# EasyEDA schematic SCH_Visualizer_2026-05-25.json
TITLE: Visualizer; REV: 1.0; Date: 2026-05-23; Sheet: 1/1; Drawn By: jshimamoto; Company: Your Company
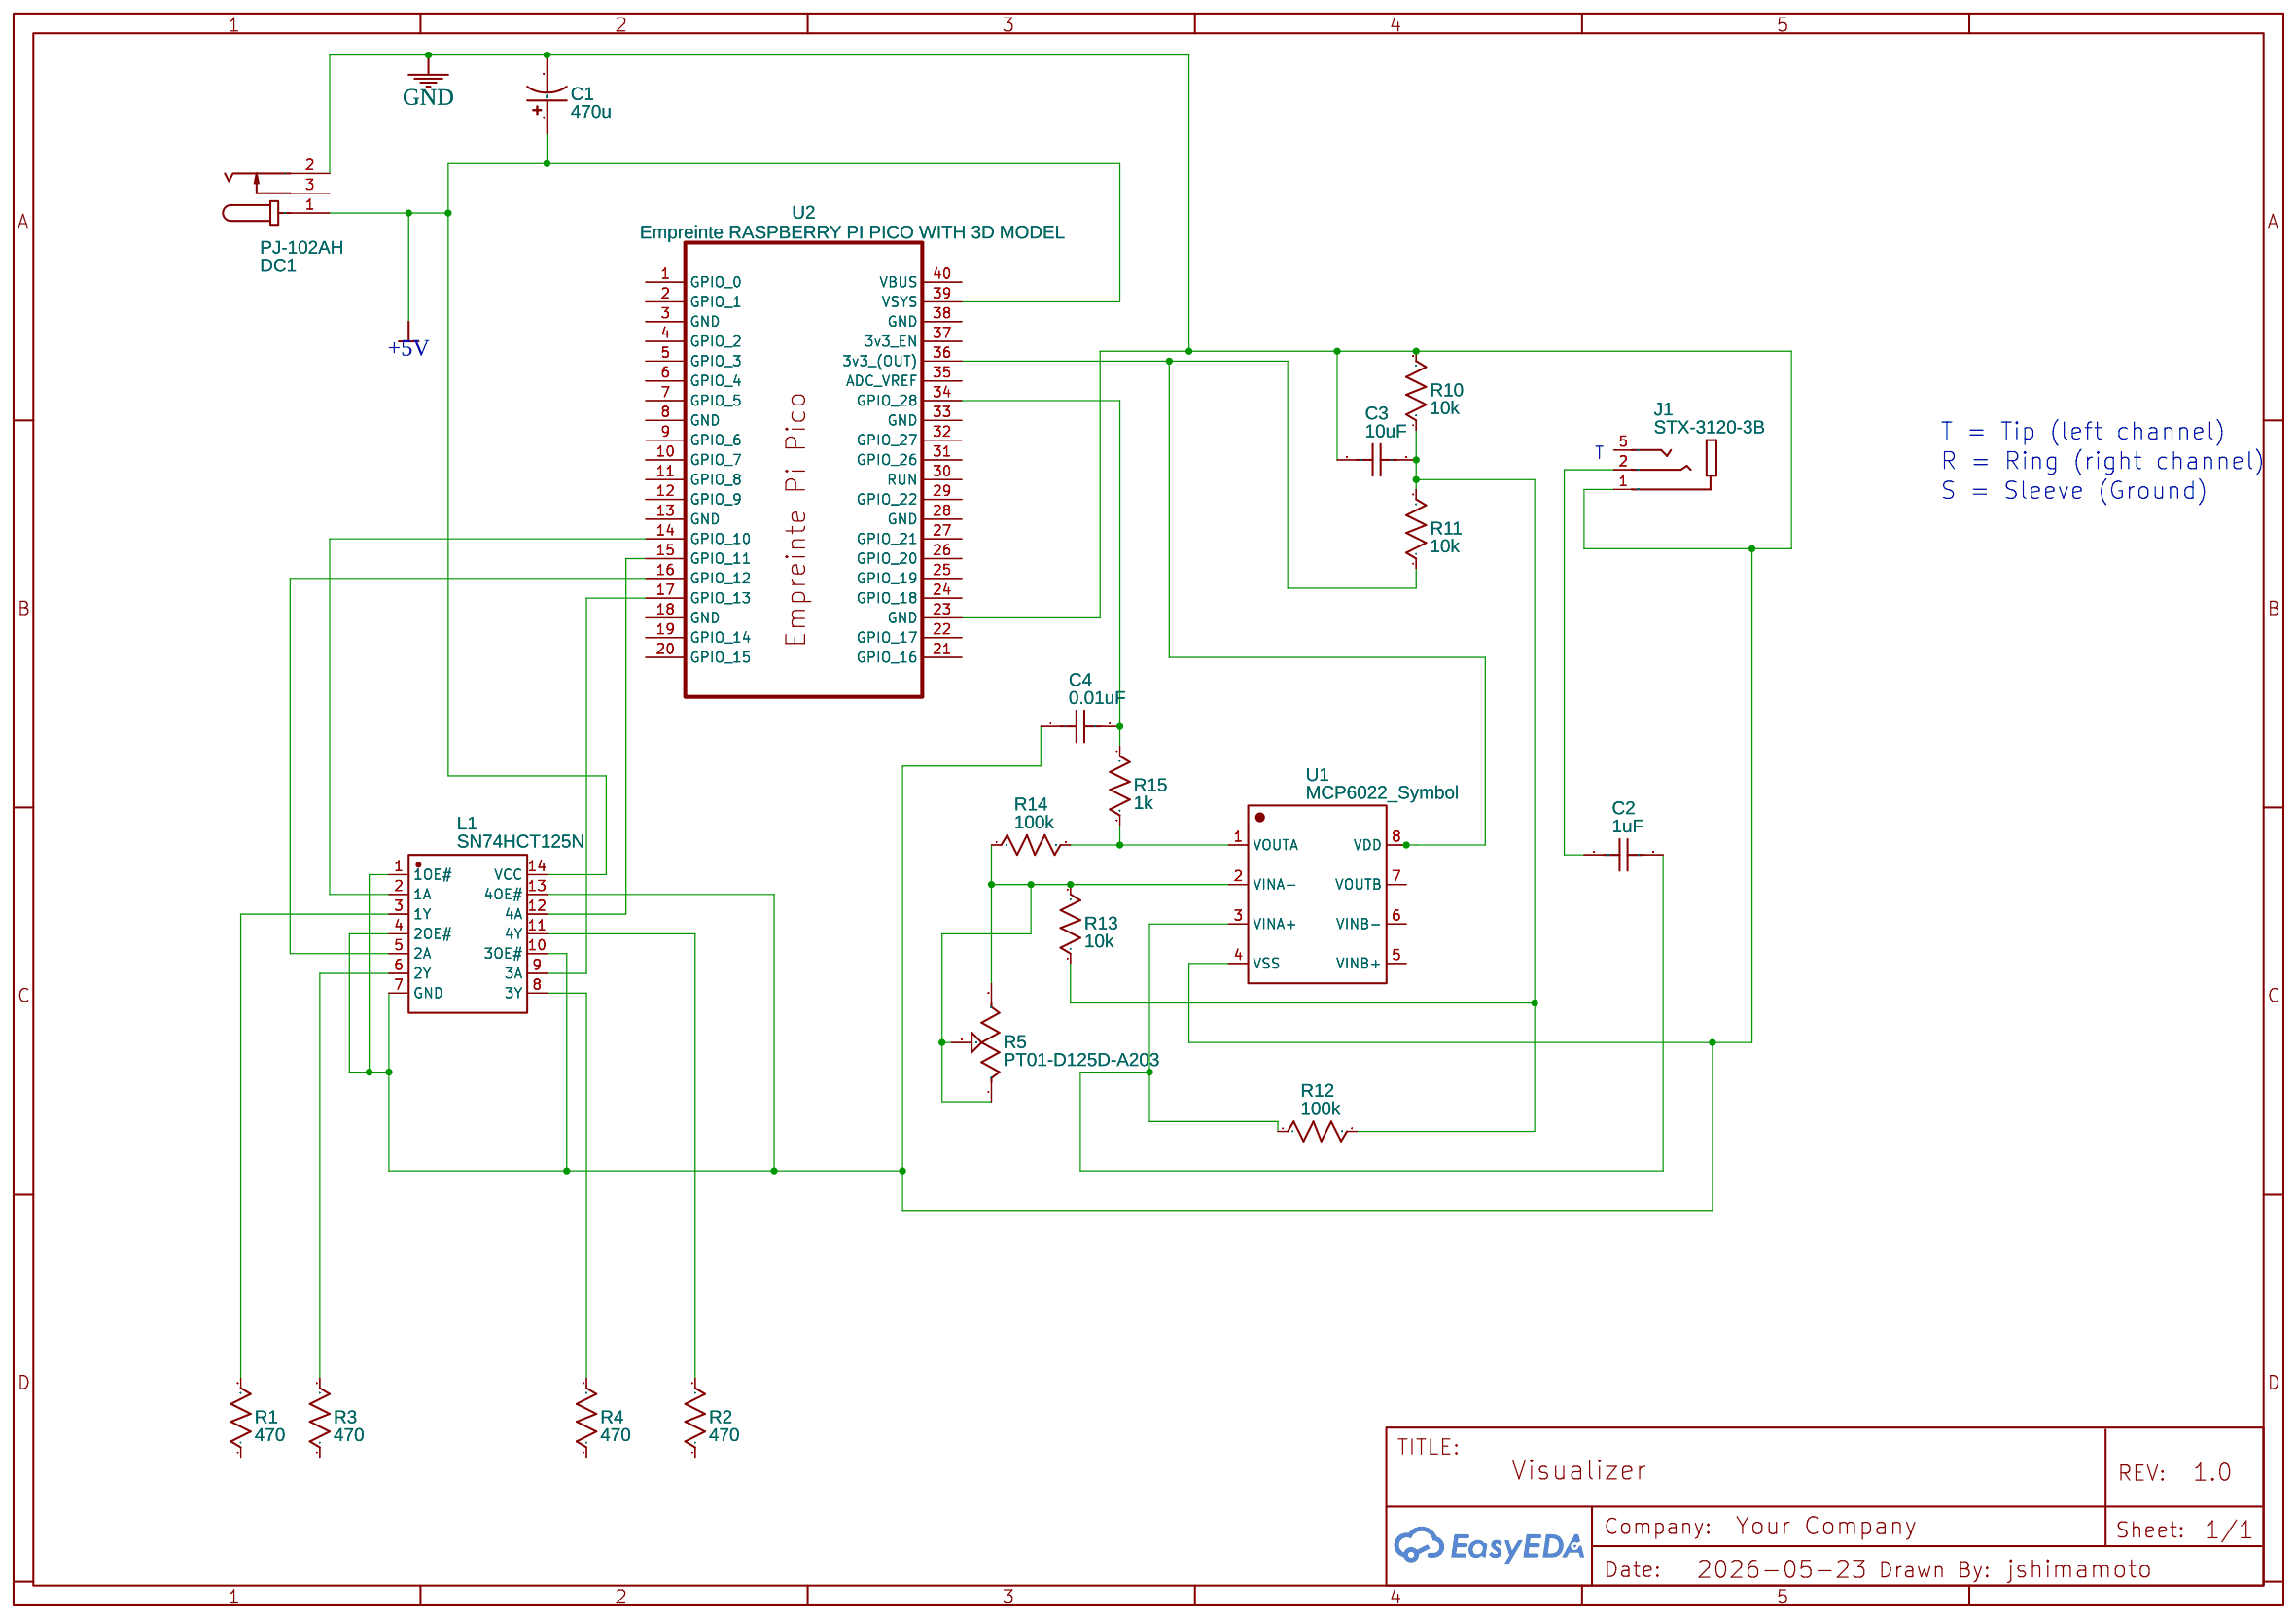
[diagram p0: schematic sheet]

## Parts
C1  470u  [CP_RADIAL_D12.5MM_P5.00MM]
C2  1uF  [CPOL-RADIAL-10UF-25V]
C3  10uF  [CPOL-RADIAL-10UF-25V]
C4  0.01uF  [CPOL-RADIAL-10UF-25V]
DC1  PJ-102AH  [DC-IN-PJ-102AH]
J1  STX-3120-3B  [KYCON_STX-3120-3B]
L1  SN74HCT125N  [PDIP-14_L19.3-W6.4-P2.54-LS7.6-BL]
R1  470  [R_AXIAL-0.3]
R2  470  [R_AXIAL-0.3]
R3  470  [R_AXIAL-0.3]
R4  470  [R_AXIAL-0.3]
R5  PT01-D125D-A203  [TRIM_PT01-D125D-A203]
R10  10k  [R_AXIAL-0.3]
R11  10k  [R_AXIAL-0.3]
R12  100k  [R_AXIAL-0.3]
R13  10k  [R_AXIAL-0.3]
R14  100k  [R_AXIAL-0.3]
R15  1k  [R_AXIAL-0.3]
U1  MCP6022_Symbol  [MCP6022_FOOTPRINT]
U2  Empreinte RASPBERRY PI PICO WITH 3D MODEL  [RASPBERRY PI PICO/ RASPBERRY PI PICO W]

## Library data of the parts
C1 = C_Tan_SMD_A_US: Contributor: LCEDA_Lib
C2-C4 = C_0603_US: Contributor: LCEDA_Lib
DC1 = PJ-102AH: Supplier: Digi-Key; Supplier Part: CP-102AH-ND; Manufacturer: CUI Devices; Contributor: Risto_H; Assembly Type: manualWeld; Paste Type: expand; link: https://www.digikey.fi/product-detail/en/nkk-switches/B12JJVC/B12JJVC-ND/2103892
J1 = STX-3120-3B: Contributor: formabletech
L1 = SN74HCT125N: Contributor: LCSC; Supplier: LCSC; Supplier Part: C154102; Manufacturer: TI(德州仪器); JLCPCB Part Class: Extended Part
R1-R4 R10-R15 = R_0603_US: Contributor: LCEDA_Lib
R5 = PT01-D125D-A203: Contributor: bhanson
U1 = MCP6022_Symbol: Contributor: flangonflam
U2 = Empreinte RASPBERRY PI PICO WITH 3D MODEL: Contributor: Canou

## Nets
+5V: C1.1 DC1.1 L1.14(VCC) U2.39(VSYS)
GND: C1.2 C3.1 C4.1 DC1.2 J1.1(SLEEVE) L1.1(1OE#) L1.4(2OE#) L1.7(GND) L1.10(3OE#) L1.13(4OE#) R10.2 U1.4(VSS) U2.23(GND)
Net-(C2-1): C2.1 J1.2(RING)
Net-(C2-2): C2.2 R12.1 U1.3(VINA+)
Net-(C3-2): C3.2 R10.1 R11.2 R12.2 R13.1
Net-(C4-2): C4.2 R15.1 U2.34(GPIO 28)
Net-(L1-2): L1.2(1A) U2.14(GPIO 10)
Net-(L1-3): L1.3(1Y) R1.2
Net-(L1-5): L1.5(2A) U2.16(GPIO 12)
Net-(L1-6): L1.6(2Y) R3.2
Net-(L1-8): L1.8(3Y) R4.2
Net-(L1-9): L1.9(3A) U2.17(GPIO 13)
Net-(L1-11): L1.11(4Y) R2.2
Net-(L1-12): L1.12(4A) U2.15(GPIO 11)
Net-(R5-1): R5.1 R5.2 R5.3 R13.2 R14.1 U1.2(VINA-)
Net-(R11-1): R11.1 U1.8(VDD) U2.36(3v3 (OUT))
Net-(R14-2): R14.2 R15.2 U1.1(VOUTA)

Not connected (* = marked no-connect by the designer): DC1 3; J1 5(TIP); R1 1; R2 1; R3 1; R4 1; U1 5(VINB+) 6(VINB-) 7(VOUTB); U2 1(GPIO 0) 2(GPIO 1) 3(GND) 4(GPIO 2) 5(GPIO 3) 6(GPIO 4) 7(GPIO 5) 8(GND) 9(GPIO 6) 10(GPIO 7) 11(GPIO 8) 12(GPIO 9) 13(GND) 18(GND) 19(GPIO 14) 20(GPIO 15) 21(GPIO 16) 22(GPIO 17) 24(GPIO 18) 25(GPIO 19) 26(GPIO 20) 27(GPIO 21) 28(GND) 29(GPIO 22) 30(RUN) 31(GPIO 26) 32(GPIO 27) 33(GND) 35(ADC_VREF) 37(3v3_EN) 38(GND) 40(VBUS)

## Notes on the sheet
- T = Tip (left channel)
- T
- R = Ring (right channel)
- S = Sleeve (Ground)
